# EAGLE design HydraNFC_v1_1_Rev1 (EAGLE 7.1.0)
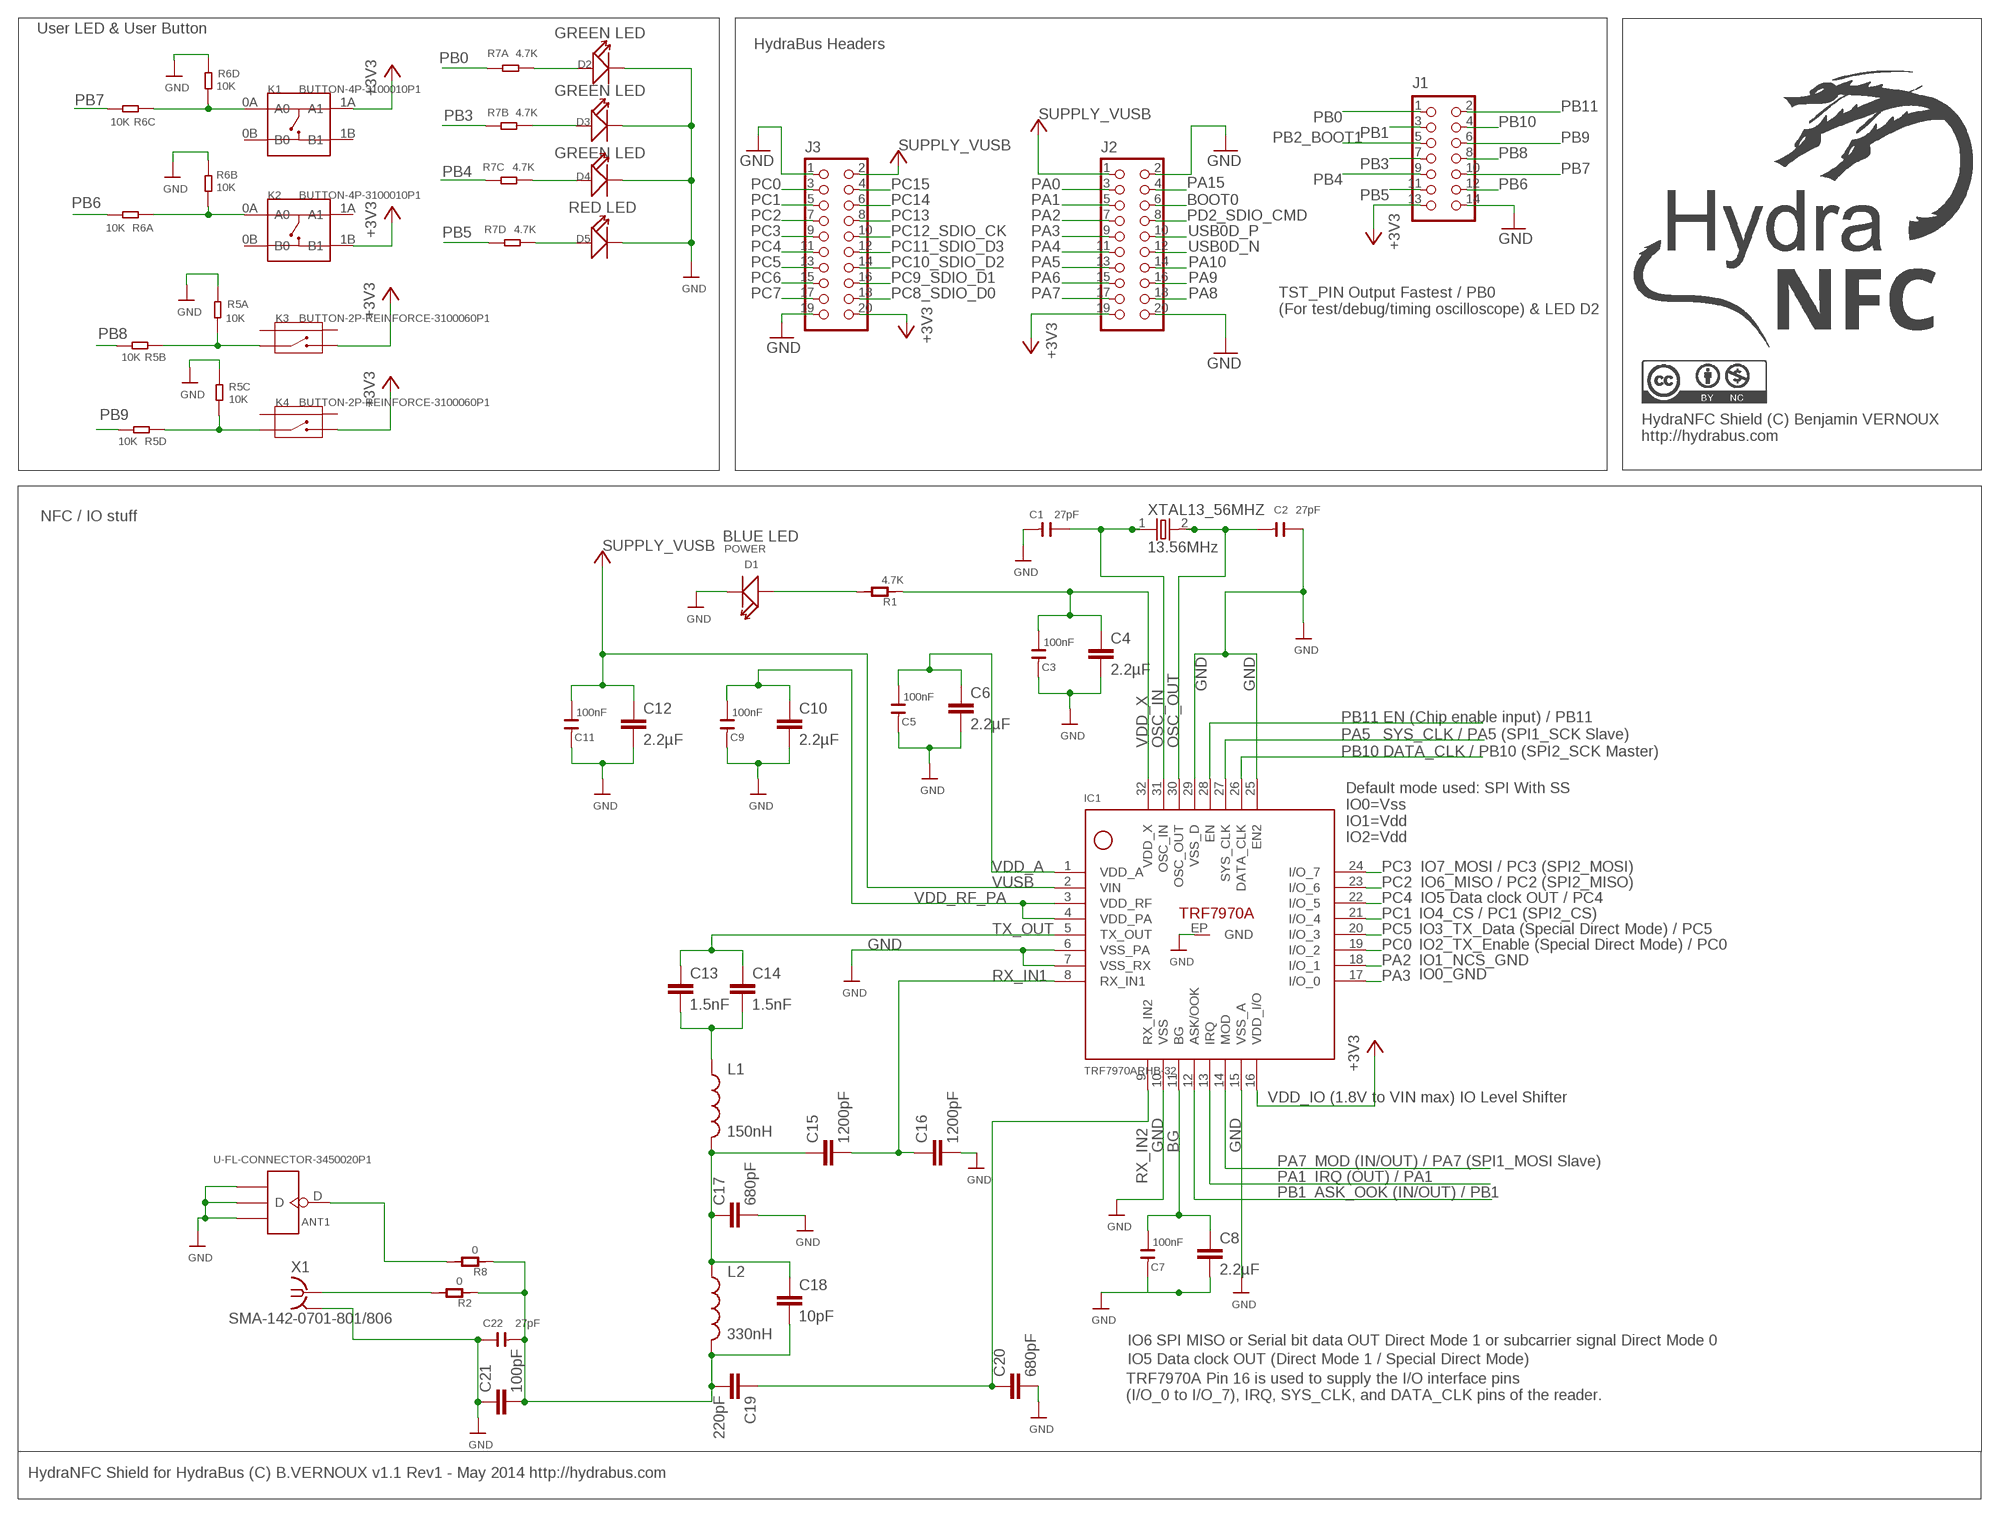
[diagram p0: schematic, sheet 1]

## Parts
ANT1  U-FL-CONNECTOR-3450020P1  [U-FL]
C1  27pF  C-0603  [C0603]
C2  27pF  C-0603  [C0603]
C3  100nF  C-0603  [C0603]
C4  2.2µF  CAPC805  [C805]
C5  100nF  C-0603  [C0603]
C6  2.2µF  CAPC805  [C805]
C7  100nF  C-0603  [C0603]
C8  2.2µF  CAPC805  [C805]
C9  100nF  C-0603  [C0603]
C10  2.2µF  CAPC805  [C805]
C11  100nF  C-0603  [C0603]
C12  2.2µF  CAPC805  [C805]
C13  1.5nF  CAPC805  [C805]
C14  1.5nF  CAPC805  [C805]
C15  1200pF  CAPC805  [C805]
C16  1200pF  CAPC805  [C805]
C17  680pF  CAPC805  [C805]
C18  10pF  CAPC805  [C805]
C19  220pF  CAPC805  [C805]
C20  680pF  CAPC805  [C805]
C21  100pF  CAPC805  [C805]
C22  27pF  C-0603  [C0603]
D1  POWER  LED  [LED0603]
D2  LED  [LED0603]
D3  LED  [LED0603]
D4  LED  [LED0603]
D5  LED  [LED0603]
IC1  TRF7970ARHB-32  TRF7970A  [TRF7970A]
J1  HYDRABUS_SHIELD_CON_HEADER_2X07  [HYDRABUS_SHIELD_M2X7]
J2  HYDRABUS_SHIELD_CON_HEADER_2X10  [HYDRABUS_SHIELD_M2X10]
J3  HYDRABUS_SHIELD_CON_HEADER_2X10  [HYDRABUS_SHIELD_M2X10]
K1  BUTTON-4P-3100010P1  [4P-SMD-6.0X6.0X5.0H]
K2  BUTTON-4P-3100010P1  [4P-SMD-6.0X6.0X5.0H]
K3  BUTTON-2P-REINFORCE-3100060P1  [4P-SMD-7.0X3.5X3.5H-90D]
K4  BUTTON-2P-REINFORCE-3100060P1  [4P-SMD-7.0X3.5X3.5H-90D]
L1  150nH  INDUCTOR1210  [1210]
L2  330nH  INDUCTOR1210  [1210]
R1  4.7K  R-0603  [R0603]
R2  0  R-0603  [R0603]
R5  10K  R-4R  [R1206-8]
R6  10K  R-4R  [R1206-8]
R7  4.7K  R-4R  [R1206-8]
R8  0  R-0603  [R0603]
X1  SMA-142-0701-801/806  [J502-ND-142-0701-801/806]
XTAL13_56MHZ  13.56MHz  OSC-XTAL  [HC-49U]

## Nets
+3V3 [VDD]: IC1.16(VDD_I/O) J1.13 J2.19 J3.20 K1.1A(A1) K2.1B(B1) K3.2 K4.2
BG: C7.2 C8.1 IC1.11(BG)
BOOT0: J2.6
GND: ANT1.GND1 ANT1.GND2 ANT1.GND3 C1.1 C2.2 C3.1 C4.2 C5.1 C6.2 C7.1 C8.2 C9.1 C10.2 C11.1 C12.2 C16.2 C17.2 C20.2 C21.1 C22.2 D1.- D2.- D3.- D4.- D5.- IC1.6(VSS_PA) IC1.7(VSS_RX) IC1.10(VSS) IC1.15(VSS_A) IC1.25(EN2) IC1.29(VSS_D) IC1.EP(GND) J1.14 J2.2 J2.20 J3.1 J3.19 R5.3 R5.8 R6.4 R6.7 X1.G@1(GND)
N$1: C13.2 C14.2 L1.1
N$4: C18.2 C19.2 C21.2 C22.1 L2.2 R2.2 R8.2
N$7: C15.1 C17.1 C18.1 L1.2 L2.1
N$9: D1.+ R1.1
N$11: R2.1 X1.1
N$12: K3.1 R5.1 R5.2
N$13: K2.0A(A0) R6.2 R6.8
N$14: K4.1 R5.5 R5.6
N$15: K1.0A(A0) R6.3 R6.5
N$16: D2.+ R7.8
N$17: D3.+ R7.7
N$18: D4.+ R7.6
N$19: D5.+ R7.5
N$20: ANT1.D R8.1
OSC_IN: C1.2 IC1.31(OSC_IN) XTAL13_56MHZ.1
OSC_OUT: C2.1 IC1.30(OSC_OUT) XTAL13_56MHZ.2
PA0: J2.3
PA1: IC1.13(IRQ) J2.5
PA2: IC1.18(I/O_1) J2.7
PA3: IC1.17(I/O_0) J2.9
PA4: J2.11
PA5: IC1.27(SYS_CLK) J2.13
PA6: J2.15
PA7: IC1.14(MOD) J2.17
PA8: J2.18
PA9: J2.16
PA10: J2.14
PA15: J2.4
PB0: J1.1 R7.1
PB1: IC1.12(ASK/OOK) J1.3
PB2_BOOT1: J1.5
PB3: J1.7 R7.2
PB4: J1.9 R7.3
PB5: J1.11 R7.4
PB6: J1.12 R6.1
PB7: J1.10 R6.6
PB8: J1.8 R5.7
PB9: J1.6 R5.4
PB10: IC1.26(DATA_CLK) J1.4
PB11: IC1.28(EN) J1.2
PC0: IC1.19(I/O_2) J3.3
PC1: IC1.21(I/O_4) J3.5
PC2: IC1.23(I/O_6) J3.7
PC3: IC1.24(I/O_7) J3.9
PC4: IC1.22(I/O_5) J3.11
PC5: IC1.20(I/O_3) J3.13
PC6: J3.15
PC7: J3.17
PC8_SDIO_D0: J3.18
PC9_SDIO_D1: J3.16
PC10_SDIO_D2: J3.14
PC11_SDIO_D3: J3.12
PC12_SDIO_CK: J3.10
PC13: J3.8
PC14: J3.6
PC15: J3.4
PD2_SDIO_CMD: J2.8
RX_IN1: C15.2 C16.1 IC1.8(RX_IN1)
RX_IN2: C19.1 C20.1 IC1.9(RX_IN2)
TX_OUT: C13.1 C14.1 IC1.5(TX_OUT)
USB0D_N: J2.12
USB0D_P: J2.10
VDD_A: C5.2 C6.1 IC1.1(VDD_A)
VDD_RF_PA: C9.2 C10.1 IC1.3(VDD_RF) IC1.4(VDD_PA)
VDD_X: C3.2 C4.1 IC1.32(VDD_X) R1.2
VUSB [POWER]: C11.2 C12.1 IC1.2(VIN) J2.1 J3.2 ; supply symbol labelled SUPPLY_VUSB
Unconnected: K1.0B(B0) K1.1B(B1) K2.0B(B0) K2.1A(A1) K3.S1 K3.S2 K4.S1 K4.S2

## Notes on the sheet
- User LED & User Button
- GREEN LED
- HydraBus Headers
- GREEN LED
- GREEN LED
- RED LED
- TST_PIN Output Fastest / PB0
  (For test/debug/timing oscilloscope) & LED D2
- HydraNFC Shield (C) Benjamin VERNOUX
  http://hydrabus.com
- NFC / IO stuff
- BLUE LED
- EN (Chip enable input) / PB11
- SYS_CLK / PA5 (SPI1_SCK Slave)
- DATA_CLK / PB10 (SPI2_SCK Master)
- Default mode used: SPI With SS
  IO0=Vss
  IO1=Vdd
  IO2=Vdd
- IO7_MOSI / PC3 (SPI2_MOSI)
- IO6_MISO / PC2 (SPI2_MISO)
- IO5 Data clock OUT / PC4
- IO4_CS / PC1 (SPI2_CS)
- IO3_TX_Data (Special Direct Mode) / PC5
- IO2_TX_Enable (Special Direct Mode) / PC0
- IO1_NCS_GND
- IO0_GND
- VDD_IO (1.8V to VIN max) IO Level Shifter
- MOD (IN/OUT) / PA7 (SPI1_MOSI Slave)
- IRQ (OUT) / PA1
- ASK_OOK (IN/OUT) / PB1
- IO6 SPI MISO or Serial bit data OUT Direct Mode 1 or subcarrier signal Direct Mode 0
- IO5 Data clock OUT (Direct Mode 1 / Special Direct Mode)
- TRF7970A Pin 16 is used to supply the I/O interface pins
  (I/O_0 to I/O_7), IRQ, SYS_CLK, and DATA_CLK pins of the reader.
- HydraNFC Shield for HydraBus (C) B.VERNOUX v1.1 Rev1 - May 2014 http://hydrabus.com

## Power pins joined to a net without a drawn wire
GND: X1.G@2(GND) X1.G@3(GND) X1.G@4(GND)

## Library data of the parts
ANT1 = OPL Eagle Library:U-FL-CONNECTOR
C1 C2 C22 = OPL:C*; OPL: 0100410P1
C3 C5 C7 C9 C11 = OPL:C*; OPL: 0100020P1
C4 C6 C8 C10 C12-C21 = dp_devices:CAP
D1 = OPL:LED*: LED; OPL: 0330060P1
D2-D4 = OPL Eagle Library:LED*: LED; OPL: 0330010P1
D5 = OPL Eagle Library:LED*: LED; OPL: 0330020P1
IC1 = 0ben:TRF7970A: Texas Instrument TRF7970A MULTI-PROTOCOL FULLY INTEGRATED 13.56-MHz RFID/NEAR FIELD COMMUNICATION (NFC) TRANSCEIVER IC. Package: RHB 32 pins (VQFN) Plastic Flat Pack, Width 5mm, Length 5mm, Thickness 0.9mm, Pitch 0.5mm, Max Height 1mm, JEDEDC S-PQFP-N See http://www.ti.com/sc/docs/psheets/type/vqfn.html for more details
J1 = hydrabus_shield:HYDRABUS_SHIELD_CON_HEADER_2X07: 2x7 Pin header
J2 J3 = hydrabus_shield:HYDRABUS_SHIELD_CON_HEADER_2X10: 2x10 Pin header
K1 K2 = OPL:BUTTON-4P; OPL: 3100010P1
K3 K4 = OPL:BUTTON-2P-REINFORCE: TS-1188E http://www.best-dz.com/?thread-374-2.html SMD Button; OPL: 3100060P1
L1 L2 = SparkFun:INDUCTOR: Inductors Basic Inductor/Choke - 0603 and 1206. Footprints are not proven and vary greatly between part numbers.
R1 = OPL:R*; OPL: 0010030P1
R2 R8 = OPL:R*; OPL: 0010070P1
R5 R6 = OPL Eagle Library:R-4R*: Resistor Array; OPL: 0040070P1
R7 = OPL Eagle Library:R-4R*: Resistor Array; OPL: 0040040P1
X1 = con-coax:SMA-: SMA 50 Ohm End Launch Jack Receptacle - Round Contact Johnson Components Source: www.johnsoncomponents.com .. J502-ND.pdf; MF: JOHNSON COMPONENTS; MPN: 142-0701-801; OC_FARNELL: 1608592; OC_NEWARK: 90F2624
XTAL13_56MHZ = dp_devices:OSC-XTAL

## Net classes
0 default: width 0.203 mm, drill 0.33 mm, clearance 0.152 mm
1 POWER: width 0.203 mm, drill 0.33 mm, clearance 0.152 mm
2 VDD: width 0.254 mm, drill 0.33 mm, clearance 0.152 mm

## Board
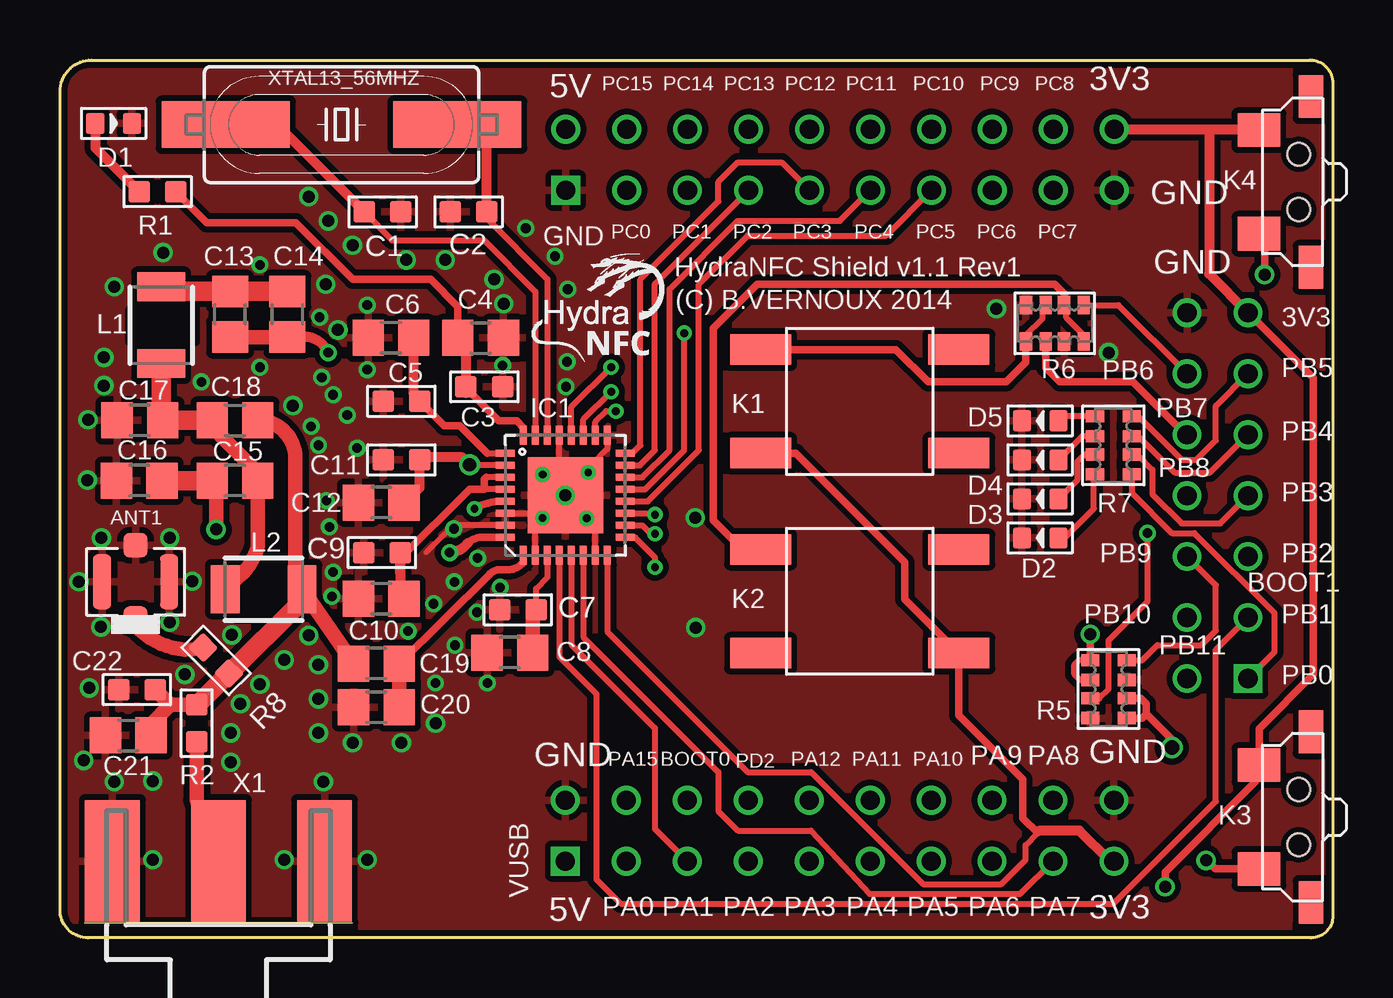
[diagram p1: board, top side]
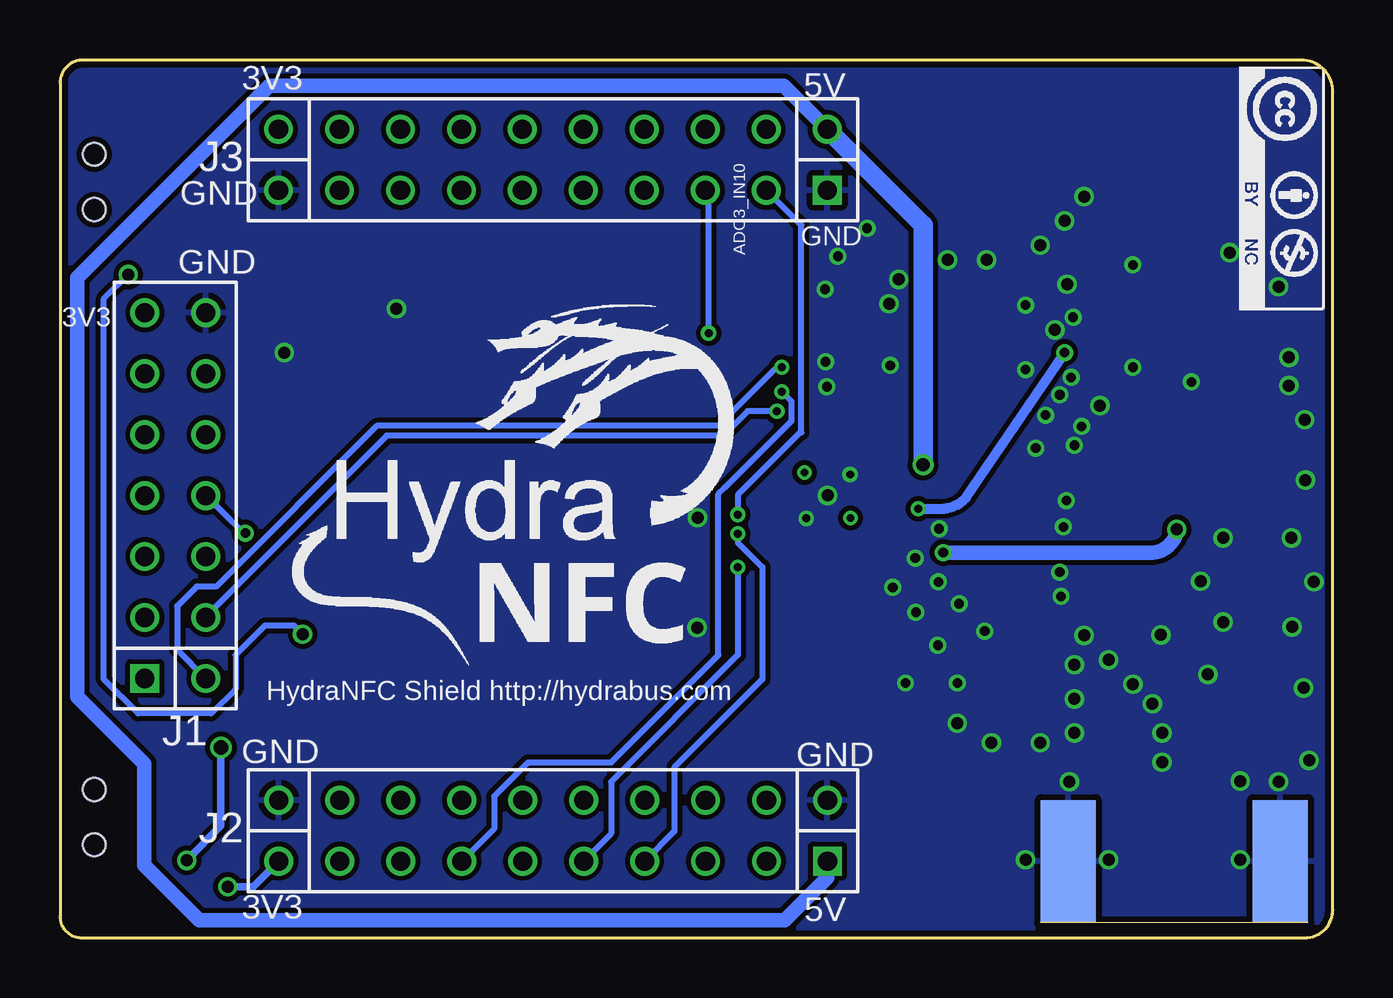
[diagram p2: board, bottom side, seen from below]

Size 53.04 x 36.58 mm. Coordinates in mm from the lower left corner, seen from the top.
Outline: 52.13,0 1.17,0 arc-90 0,1.17 0,35.26 arc-90 1.32,36.58 52.08,36.58 arc-90 53.03,35.62 53.03,0.9 arc-90 52.13,0
Copper layers (1*16): Top 0.035mm / dielectric 0.2mm / Bottom 0.035mm
Design rules "SeeedStudio_DRU_no_angle_20130527_2layers": minimum track width 6mil, minimum drill 12mil, track to track 6mil, track to pad 6mil, pad to pad 6mil, via to via 6mil, smd to smd 0mil, copper to edge 10mil, drill to drill 10mil, minimum pad ring 6mil, minimum via ring 6mil, stop-mask expansion 2mil, vias tented up to drill 25mil, thermal gap 10mil

### Footprints (pad centres in the part's own frame; a part is rotated, then mirrored left to right if it is on the bottom)
U-FL = smd 1.016 x 1.016: D -1.524,0; GND3 1.524,0 | smd 2.286 x 0.762: GND1 0,1.397; GND2 0,-1.397
C0603 = smd 0.889 x 0.889: 1 -0.762,0; 2 0.762,0
C805 = smd 1.3 x 1.5: 1 -0.95,0; 2 0.95,0
LED0603 = smd 0.762 x 0.889: + -0.762,0; - 0.762,0
TRF7970A = smd 0.8 x 0.285: 1 -2.5,1.75; 2 -2.5,1.25; 3 -2.5,0.75; 4 -2.5,0.25; 5 -2.5,-0.25; 6 -2.5,-0.75; 7 -2.5,-1.25; 8 -2.5,-1.75; 17 2.5,-1.75; 18 2.5,-1.25; 19 2.5,-0.75; 20 2.5,-0.25; 21 2.5,0.25; 22 2.5,0.75; 23 2.5,1.25; 24 2.5,1.75 | smd 0.285 x 0.8: 9 -1.75,-2.5; 10 -1.25,-2.5; 11 -0.75,-2.5; 12 -0.25,-2.5; 13 0.25,-2.5; 14 0.75,-2.5; 15 1.25,-2.5; 16 1.75,-2.5; 25 1.75,2.5; 26 1.25,2.5; 27 0.75,2.5; 28 0.25,2.5; 29 -0.25,2.5; 30 -0.75,2.5; 31 -1.25,2.5; 32 -1.75,2.5 | smd 3.15 x 3.15: EP 0,0 | drill 0.305: P$1 -0.953,-0.953; P$2 0.953,0.953
HYDRABUS_SHIELD_M2X7 = drill 0.8 square: 1 -7.62,-1.27 | drill 0.8: 2 -7.62,1.27; 3 -5.08,-1.27; 4 -5.08,1.27; 5 -2.54,-1.27; 6 -2.54,1.27; 7 0,-1.27; 8 0,1.27; 9 2.54,-1.27; 10 2.54,1.27; 11 5.08,-1.27; 12 5.08,1.27; 13 7.62,-1.27; 14 7.62,1.27
HYDRABUS_SHIELD_M2X10 = drill 0.8 square: 1 -11.43,-1.27 | drill 0.8: 2 -11.43,1.27; 3 -8.89,-1.27; 4 -8.89,1.27; 5 -6.35,-1.27; 6 -6.35,1.27; 7 -3.81,-1.27; 8 -3.81,1.27; 9 -1.27,-1.27; 10 -1.27,1.27; 11 1.27,-1.27; 12 1.27,1.27; 13 3.81,-1.27; 14 3.81,1.27; 15 6.35,-1.27; 16 6.35,1.27; 17 8.89,-1.27; 18 8.89,1.27; 19 11.43,-1.27; 20 11.43,1.27
4P-SMD-6.0X6.0X5.0H = smd 2.54 x 1.27: 0A -4.129,2.159; 0B 4.129,2.159; 1A -4.129,-2.159; 1B 4.129,-2.159
4P-SMD-7.0X3.5X3.5H-90D = smd 1.397 x 1.778: 1 -2.159,1.651; 2 2.159,1.651 | smd 1.778 x 1.016: S1 -3.556,-0.508; S2 3.556,-0.508 | hole 0.95: -1.15,0; 1.15,0
1210 = smd 1.2 x 2: 1 -1.6,0; 2 1.6,0
R0603 = smd 0.889 x 0.889: 1 -0.762,0; 2 0.762,0
R1206-8 = smd 0.508 x 0.762: 1 -1.206,-0.762; 2 -0.381,-0.762; 3 0.381,-0.762; 4 1.206,-0.762; 5 1.206,0.762; 6 0.381,0.762; 7 -0.381,0.762; 8 -1.206,0.762
J502-ND-142-0701-801/806 = smd 5.08 x 2.286: 1 2.565,0; G@1 2.565,4.42; G@2 2.565,-4.42 | smd 5.08 x 2.286 bottom: G@3 2.565,4.42; G@4 2.565,-4.42
HC-49U = smd 5.334 x 1.93: 1 -4.826,0; 2 4.826,0

### Placement (x,y rotation side)
ANT1  3.15,14.83 90 top
C1  13.44,30.25 180 top
C2  17.03,30.25 180 top
C3  17.68,22.96 180 top
C4  17.53,24.99 0 top
C5  14.22,22.35 0 top
C6  13.79,24.99 180 top
C7  19.08,13.67 0 top
C8  18.75,11.89 180 top
C9  13.41,16.05 0 top
C10  13.39,14.12 180 top
C11  14.22,19.91 0 top
C12  13.39,18.14 180 top
C13  7.09,25.98 90 top
C14  9.47,25.98 90 top
C15  7.29,19.05 180 top
C16  3.3,19.05 180 top
C17  3.33,21.56 180 top
C18  7.29,21.56 0 top
C19  13.18,11.43 180 top
C20  13.18,9.6 180 top
C21  2.84,8.43 0 top
C22  3.2,10.34 180 top
D1  2.24,33.93 0 top
D2  40.84,16.66 180 top
D3  40.84,18.29 180 top
D4  40.84,19.91 180 top
D5  40.84,21.54 180 top
IC1  21.06,18.44 0 top
J1  48.23,18.43 90 top
J2  32.49,4.47 0 top
J3  32.5,32.42 0 top
K1  33.32,22.35 0 top
K2  33.32,14.02 0 top
K3  51.61,5.03 90 top
K4  51.61,31.5 90 top
L1  4.22,25.53 270 top
L2  8.48,14.53 0 top
R1  4.06,31.09 0 top
R2  5.69,8.94 90 top
R5  43.69,10.36 90 top
R6  41.45,25.6 180 top
R7  43.89,20.52 90 top
R8  6.5,11.56 315 top
X1  6.6,0.64 90 top
XTAL13_56MHZ  11.73,33.88 0 top

### Tracks (layer width: path | path; a pad name or v marks a point on that pad's centre or on a via)
+3V3  (via drill 0.5)
  Top 0.254: IC1.16 22.81,12.75 28.65,6.91 31.29,6.91 35.97,2.24 39.22,2.24 40.23,3.25 40.23,3.86 40.74,4.37 40.84,4.47 | K3.2 49.96,6.8
  Top 0.305: 40.74,4.37 40.11,4.98 40.11,6.6 37.45,9.28 K2.1B 35.2,14.11 35.2,15.64 30.65,20.19 K1.1A 28.32,20.19 | J1.13 49.52,26.05 52.22,23.34 52.22,10.97 49.96,8.71 K3.2 49.81,7.04 49.81,6.5 46.05,2.74 v46.05,2.13 | 43.73,3.21 J2.19
  Top 0.406: 43.73,3.21 42.47,4.47 40.84,4.47 | J3.20 47.88,33.69 | 47.88,33.69 49.93,33.69 K4.2 | 47.88,33.69 47.88,27.67 J1.13
  Top 0.61: 49.33,33.68 K4.2
  Bottom 0.305: v46.05,2.13 44.98,2.13 J2.19
BG
  Top 0.254: IC1.11 20.32,15.93 20.32,15.04 19.84,14.55 C7.2
  Top 0.61: C7.2 19.69,13.81 C8.1
GND  (via drill 0.33, 0.4, 0.5)
  Top 0.203: 16.38,17.19 15.24,16.05
  Top 0.254: IC1.6 19.49,17.69 19.51,17.68 | 19.51,17.68 19.71,17.88 20.5,17.88 IC1.EP 20.81,18.69 20.81,19.66 | IC1.10 19.81,17.38 19.51,17.68 | 20.81,19.66 IC1.29 | IC1.15 22.31,16.91 | IC1.25 22.81,20.37 22.15,19.71 21.21,19.66 20.81,19.66 | IC1.7 16.38,17.19
  Top 0.305: 22.31,16.91 22.15,17.07 22.15,17.35 IC1.EP
  other vias: 18.49,26.42 11.58,25.33 11.97,21.78 11.38,15.24 11.33,14.22 15.65,8.94 7.11,8.53 8.33,10.57 3.86,6.53 7.11,7.32 2.26,6.5 11.07,27.23 0.99,7.39 5.21,10.97 10.36,12.6 10.77,8.53 10.77,9.96 14.22,8.13 7.52,9.75 12.19,8.13 15.57,13.92 14.5,12.78 17.37,13.56 17.4,15.82 16.46,12.19 16.43,14.83 18.34,14.61 11.1,18.21 9.7,22.17 1.14,19.08 1.83,23.01 4.29,28.55 43.69,24.38 39.01,26.21 21.95,17.48 20.12,19.3 12.38,20.4 9.35,11.58 16.05,28.24 18.08,27.43 10.97,6.5 4.57,16.66 1.73,16.66 0.79,14.83 12.19,28.85 11.18,29.87 10.36,30.89 14.43,28.24 18.44,23.85 1.17,21.59 7.16,12.62 10.77,11.38 1.22,10.41 11.38,22.63 10.46,21.31 10.91,23.35 8.33,23.77 8.33,28.04 2.26,27.13 1.83,24.18 5.89,23.16 10.82,25.86 3.86,3.25 12.8,3.25 9.35,3.25 17.81,10.62 21.05,18.44 26.47,17.5 26.49,12.93 15.65,10.62 11.23,17.12 1.7,12.95 4.57,13.16 5.51,14.86 21.13,24 21.16,27.03 19.41,29.57 20.62,28.4 21.08,22.96 10.77,20.52 12.8,23.67 12.8,26.37 16.41,17.04
  pour Top (isolate 0.254): -0.62,37.51 53.3,37.51 53.3,-0.75 -1.03,-0.75
  pour Bottom (isolate 0.203): -1.7,38.54 53.44,38.54 53.44,-1.57 -1.9,-1.57
N$1
  Top 0.813: L1.1 4.41,26.93 C13.2 C14.2
N$4
  Top 0.61: R2.2 4.6,9.7 | 4.6,9.7 C22.1 | C21.2 3.79,8.9 4.6,9.7 | C19.2 L2.2 10.08,15 arc90 9.8,15.29 9.8,20 arc90 C18.2
  Top 0.813: R2.2 5.73,9.7 R8.2 7.06,11.02 9.98,13.94 9.98,14.42 L2.2
N$6
  cutout Top: 7.32,13.21 8.33,13.21 9.14,14.02 9.14,15.65 9.35,15.85 8.74,15.85 8.74,15.65 7.72,14.63 7.72,13.41
N$7
  Top 0.61: C18.1 6.7,21.2 6.7,20.92 8.24,19.39 C15.1 8.24,16.32 arc-27 7.62,15.18 L2.1
  Top 0.813: C18.1 4.77,21.56 | 4.77,21.56 C17.1 | L1.2 4.22,22.12 4.77,21.56
N$9
  Top 0.406: D1.+ 1.47,32.92 R1.1
N$10
  cutout Top: 2.84,24.79 2.84,26.21 5.28,26.21 5.49,26.42 5.69,26.21 5.69,24.79
N$11
  Top 0.61: R2.1 5.69,5.74 X1.1
N$12  (via drill 0.5, 0.6)
  Top 0.254: 44.46,9.14 R5.1 44.5,9.11
  Top 0.305: v47.75,3.23 48.13,2.87 K3.1 | R5.1 45.1,9.16 45.26,9.32 | R5.2 45.03,9.98 45.26,9.75 45.26,9.32 | 45.26,9.32 45.28,9.32 46.33,8.27 v46.33,7.92
  Bottom 0.305: v46.33,7.92 46.33,4.67 v47.75,3.23
N$13
  Top 0.254: R6.8 42.66,25.1 41.93,25.83 41.93,26.27 R6.2
  Top 0.305: 41.86,26.39 41.86,26.82 41.45,27.23 29.06,27.23 27.23,25.4 27.23,17.39 28.85,15.77
  Top 0.406: K2.0A 29.79,15.77 28.85,15.77 | 41.86,26.39 R6.2
N$14  (via drill 0.5)
  Top 0.254: R5.6 42.49,10.74 42.27,10.97 42.27,11.38 42.46,11.57 R5.5
  Top 0.305: v50.19,27.64 50.19,29.11 | R5.5 v42.93,12.65
  Top 0.406: 50.19,29.11 K4.1
  Bottom 0.254: v42.93,12.65 43.28,13 44.5,13 45.72,11.79 45.72,10.36 46.74,9.35 49.78,9.35 51.21,10.77 51.21,26.62 v50.19,27.64
N$15
  Top 0.254: R6.5 40.25,25.11 40.94,25.8 40.94,26.24 R6.3
  Top 0.305: K1.0A 34.82,24.51 36.17,23.16 39.42,23.16 40.25,23.99 R6.5
N$16
  Top 0.254: D2.+ 41.86,16.66 43.08,17.88 43.08,19.27 R7.8
N$17
  Top 0.254: R7.7 42.7,20.14 42.39,19.84 42.39,19.08 D3.+
N$18
  Top 0.254: R7.6 42.6,20.9 D4.+
N$19
  Top 0.254: R7.5 41.8,21.73 D5.+
N$20
  Top 0.61: 3.1,13.26 arc-90 ANT1.D 3.15,13.02 arc45 5.2,12.01 5.9,12.03 | 5.9,12.03 arc90 R8.1 arc-90 5.9,12.03
OSC_IN
  Top 0.254: IC1.31 19.81,26.93 17.68,29.06 13.84,29.06 C1.2 | 8.61,33.68 8.33,33.68 | 8.33,33.68 XTAL13_56MHZ.1 | 9.14,33.32 8.69,33.32 8.33,33.68
  Top 0.406: C1.2 9.05,33.88 XTAL13_56MHZ.1
OSC_OUT
  Top 0.254: IC1.30 20.31,27.45 17.78,29.97 C2.1
  Top 0.406: C2.1 17.79,33.83 17.27,34.34 17.01,34.34 XTAL13_56MHZ.2
PA1
  Top 0.254: IC1.13 21.31,12.22 24.79,8.74 24.79,4.54 J2.5
PA2  (via drill 0.33)
  Top 0.254: v24.79,16.83 24.62,16.83 24.26,17.19 IC1.18
  Bottom 0.254: v24.79,16.83 24.79,16.46 23.77,15.44 23.77,10.77 27.43,7.11 27.43,4.44 J2.7
PA3  (via drill 0.33)
  Top 0.254: IC1.17 23.56,16.68 23.98,16.68 23.98,16.66 24.79,15.85 v24.79,15.44
  Bottom 0.254: v24.79,15.44 24.79,11.79 30.07,6.5 30.07,4.34 J2.9
PA5  (via drill 0.33)
  Top 0.254: IC1.27 21.81,21.6 v22.96,22.76
  Bottom 0.254: 25.6,18.49 | v22.96,22.76 22.55,22.35 22.55,21.54 25.34,18.76 25.6,18.49 | J2.13 34.95,4.54 34.95,5.89 33.53,7.32 30.07,7.32 25.6,11.78 25.6,18.49
PA7
  Top 0.254: IC1.14 21.81,12.53 27.43,6.91 27.43,5.28 28.24,4.47 31.29,4.47 33.73,1.83 40.01,1.83 J2.17
PB0
  Top 0.254: R7.1 44.65,18.54 46.33,16.87 47.27,16.87 50.6,13.54 50.6,11.9 J1.1
PB1
  Top 0.254: IC1.12 20.81,11.71 22.35,10.16 22.35,2.44 23.37,1.42 43.89,1.42 48.16,5.69 48.16,12.01 48.17,12.01 J1.3
PB3
  Top 0.254: R7.2 44.88,20.14 45.52,19.51 45.52,18.49 46.74,17.27 48.35,17.27 J1.7
PB4
  Top 0.254: R7.3 44.93,20.9 46.46,19.38 47.91,19.38 J1.9
PB5
  Top 0.254: J1.11 48.17,22.17 48.16,22.17 48.16,20.73 47.35,19.91 46.74,19.91 44.92,21.73 R7.4
PB6
  Top 0.254: R6.1 44.1,26.37 J1.12
  Top 0.406: 42.71,26.42 R6.1
PB7
  Top 0.305: R6.6 41.07,23.75 41.66,23.16 44.7,23.16 46.53,21.34 46.59,21.34 J1.10
PB8  (via drill 0.4)
  Top 0.254: R5.7 43.31,9.98 43.69,10.36 43.69,12.4 45.31,14.02 v45.31,16.87
  Bottom 0.254: v45.31,16.87 45.92,17.4 J1.8
PB9
  Top 0.254: R5.4 45.1,11.57 45.72,12.19 47.55,12.19 48.16,12.8 48.16,14.71 48.14,14.71 J1.6
PB10  (via drill 0.33)
  Top 0.254: IC1.26 22.31,21.49 22.76,21.95 v23.16,21.95
  Bottom 0.254: v23.16,21.95 24.38,21.95 25.4,20.93 39.42,20.93 46.96,13.39
  Bottom 0.305: 46.96,13.39 J1.4
PB11  (via drill 0.33)
  Top 0.254: IC1.28 21.31,22.12 v22.96,23.77
  Bottom 0.254: v22.96,23.77 23.16,23.77 25.6,21.34 39.83,21.34 46.53,14.63 47.35,14.63 48.16,13.82 48.16,12 J1.2
PC0  (via drill 0.33)
  Top 0.254: IC1.19 24.73,17.69 v24.79,17.63
  Bottom 0.254: J3.3 22.16,29.69 22.15,29.69 22.15,21.06 22.19,21.06 24.79,18.46 v24.79,17.64
  Bottom 0.305: v24.79,17.64 v24.79,17.63
PC1  (via drill 0.33)
  Top 0.254: IC1.21 24.38,18.69 26.01,20.32 v26.01,25.2
  Bottom 0.254: v26.01,25.2 26.01,31.01 26.02,31.01 J3.5
PC2
  Top 0.254: IC1.23 24.16,19.69 24.79,20.32 24.79,27.25 24.8,27.25 J3.7
PC3
  Top 0.254: IC1.24 23.85,20.19 24.18,20.52 24.18,27.43 27.43,30.68 27.43,31.5 28.24,32.31 30.07,32.31 J3.9
PC4
  Top 0.254: IC1.22 24.27,19.19 25.4,20.32 25.4,27.03 28.24,29.87 32.49,29.87 J3.11
PC5
  Top 0.254: IC1.20 24.49,18.19 26.62,20.32 26.62,27.23 28.65,29.26 34.42,29.26 J3.13
RX_IN1  (via drill 0.41, 0.5)
  Top 0.305: v16.23,16.05 16.36,16.05 | IC1.8 17.76,16.69 arc45 16.99,16.45
  Top 0.406: 16.36,16.05 arc40 16.99,16.45
  Top 0.61: v6.5,17.02 6.5,18.89 C15.2
  Top 0.813: C15.2 C16.1
  Bottom 0.61: v6.5,17.02 arc90 7.7,16.05 v16.23,16.05
RX_IN2
  Top 0.254: IC1.9 19.31,15.65
  Top 0.305: C19.1 17.88,15.13 arc-45 18.27,15.34 18.74,15.34 arc45 19.31,15.65
  Top 0.406: C20.1 14.13,9.46
  Top 0.61: C19.1 C20.1
TX_OUT  (via drill 0.33, 0.4)
  Top 0.254: IC1.5 18.11,18.16
  Top 0.305: 18.11,18.16 arc25 v17.27,17.88
  Top 0.406: v11.18,24.38 arc90 9.69,24.96 C14.1
  Top 0.61: C14.1 C13.1
  Bottom 0.406: v11.18,24.38 15.29,18.33 arc45 16.3,17.88 v17.27,17.88
VDD_A
  Top 0.254: 17.81,20.19 IC1.1
  Top 0.305: 17.81,20.19 16.66,21.34 16,21.34 C5.2
  Top 0.406: C5.2 14.99,22.44 14.74,22.65 C6.1
VDD_RF_PA
  Top 0.254: IC1.4 17.68,18.69 | IC1.3 17.77,19.19
  Top 0.305: C9.2 14.12,15.19 14.12,15.75 17.07,18.69 17.68,18.69 17.68,19.1 17.77,19.19
  Top 0.406: C9.2 14.17,14.49 C10.1
VDD_X
  Top 0.305: C4.1 16.58,26.3 15.44,27.43 12.19,27.43 9.83,29.79 6.12,29.79 R1.2 | 16.92,22.71 17.12,22.71 18.29,21.54 19.02,21.54 19.3,21.26 IC1.32
  Top 0.406: C4.1 16.92,24.99 C3.2 16.92,22.71
VUSB  (via drill 0.56)
  Top 0.254: 18.54,19.71 IC1.2 17.09,19.69 v17.07,19.71
  Top 0.406: v17.07,19.71 16.76,20.02 15.39,20.02 C11.2 14.99,18.75 C12.1
  Bottom 0.61: J2.1 21.06,2.51 22.83,0.73 47.24,0.73 49.53,3.02 49.53,7.26 52.32,10.05 52.32,27.5 44.32,35.5 22.89,35.5 J3.2
  Bottom 0.813: v17.07,19.71 17.07,29.69 J3.2

### Text on the board
tNames: 5V | PC15 | PC14 | PC13 | PC12 | PC11 | PC10 | PC9 | PC8 | 3V3 | GND | GND | PC0 | PC1 | PC2 | PC3 | PC4 | PC5 | PC6 | PC7 | HydraNFC Shield v1.1 Rev1 | GND | (C) B.VERNOUX 2014 | 3V3 | PB6 | PB5 | PB7 | PB4 | PB8 | PB3 | PB9 | PB2 | BOOT1 | PB10 | PB1 | PB11 | PB0 | PA15 | BOOT0 | PD2 | PA12 | PA11 | PA10 | PA9 | PA8 | GND | GND | VUSB | 5V | PA0 | PA1 | PA2 | PA3 | PA4 | PA5 | PA6 | PA7 | 3V3
bNames: 5V | 3V3 | ADC3_IN10 | GND | GND | GND | 3V3 | HydraNFC Shield http://hydrabus.com | GND | GND | 5V | 3V3